# Altium schematic sheet Sch_Salah_Motor_Driver.SchDoc
size A2; SheetNumber: 2; SheetTotal: 3
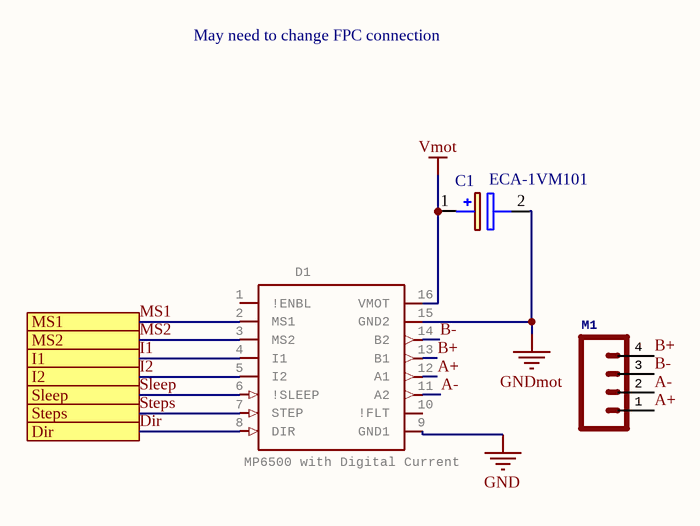
[diagram p0: Sch_Salah_Motor_Driver.SchDoc]

## Parts
C1  ECA-1VM101  [CAPPRD250W55D655H1220]
D1  MP6500 with Digital Current  [MP6500]
M1  (no value)  [JST-4-PTH-VERT]

## Ports
Dir, I1, I2, MS1, MS2, Sleep, Steps

## Nets
GND: D1.9(GND1)
GNDmot: C1.2(-) D1.15(GND2)
Vmot: C1.1(+) D1.16(VMOT)
A+: D1.12(A1) M1.1
A-: D1.11(A2) M1.2
B+: D1.13(B1) M1.4
B-: D1.14(B2) M1.3
Dir: D1.8(DIR) ; port Dir
I1: D1.4(I1) ; port I1
I2: D1.5(I2) ; port I2
MS1: D1.2(MS1) ; port MS1
MS2: D1.3(MS2) ; port MS2
Sleep: D1.6(!SLEEP) ; port Sleep
Steps: D1.7(STEP) ; port Steps

Not connected (* = marked no-connect by the designer): D1 1(!ENBL) 10(!FLT)

## Notes on the sheet
- May need to change FPC connection

## Library data of the parts
C1 = ECA-1VM101: Capacitor Polarised; Manufacturer_Name: Panasonic; Datasheet Link: http://uk.rs-online.com/web/p/products/1078023; Height: 12.2mm; Manufacturer_Part_Number: ECA-1VM101; Mouser Part Number: 667-ECA-1VM101; Mouser Price/Stock: https://www.mouser.co.uk/ProductDetail/Panasonic/ECA-1VM101?qs=F80sRR%252BEZdBICPbxyqGQug%3D%3D; Arrow Part Number: ECA-1VM101; Arrow Price/Stock: https://www.arrow.com/en/products/eca-1vm101/panasonic
D1 = 2969-MP6500: GateName_1: G$1; SymbolName_1: MP6500; LibraryName: pololu-stepper-driver; DeviceSetName: 2969-MP6500; Package: MP6500
M1 = CONN_04JST-PTH-VERT: PROD_ID: CONN-13251